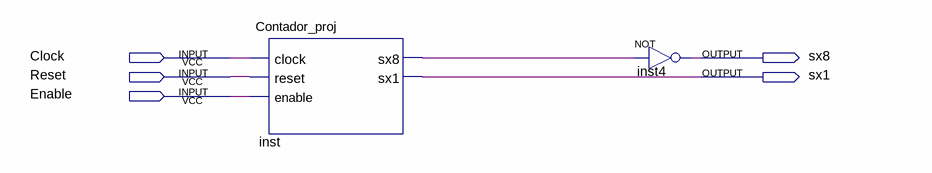
[diagram p0: schematic sheet]
// Quartus schematic Cont_proj.bdf as structural Verilog: 2 symbols, 5 pins
module Cont_proj (
  input  Clock,
  input  Reset,
  input  Enable,
  output sx8,
  output sx1
);

  wire inst_sx8;

  Contador_proj inst (.clock(Clock), .reset(Reset), .enable(Enable), .sx8(inst_sx8), .sx1(sx1));
  not inst4 (sx8, inst_sx8);
endmodule
